# Altium schematic sheet clouds_v302_1.SchDoc: clouds_v302
size 409 x 282 mm; Date: 3/31/2017 1:28:50 PM; SheetNumber: 2
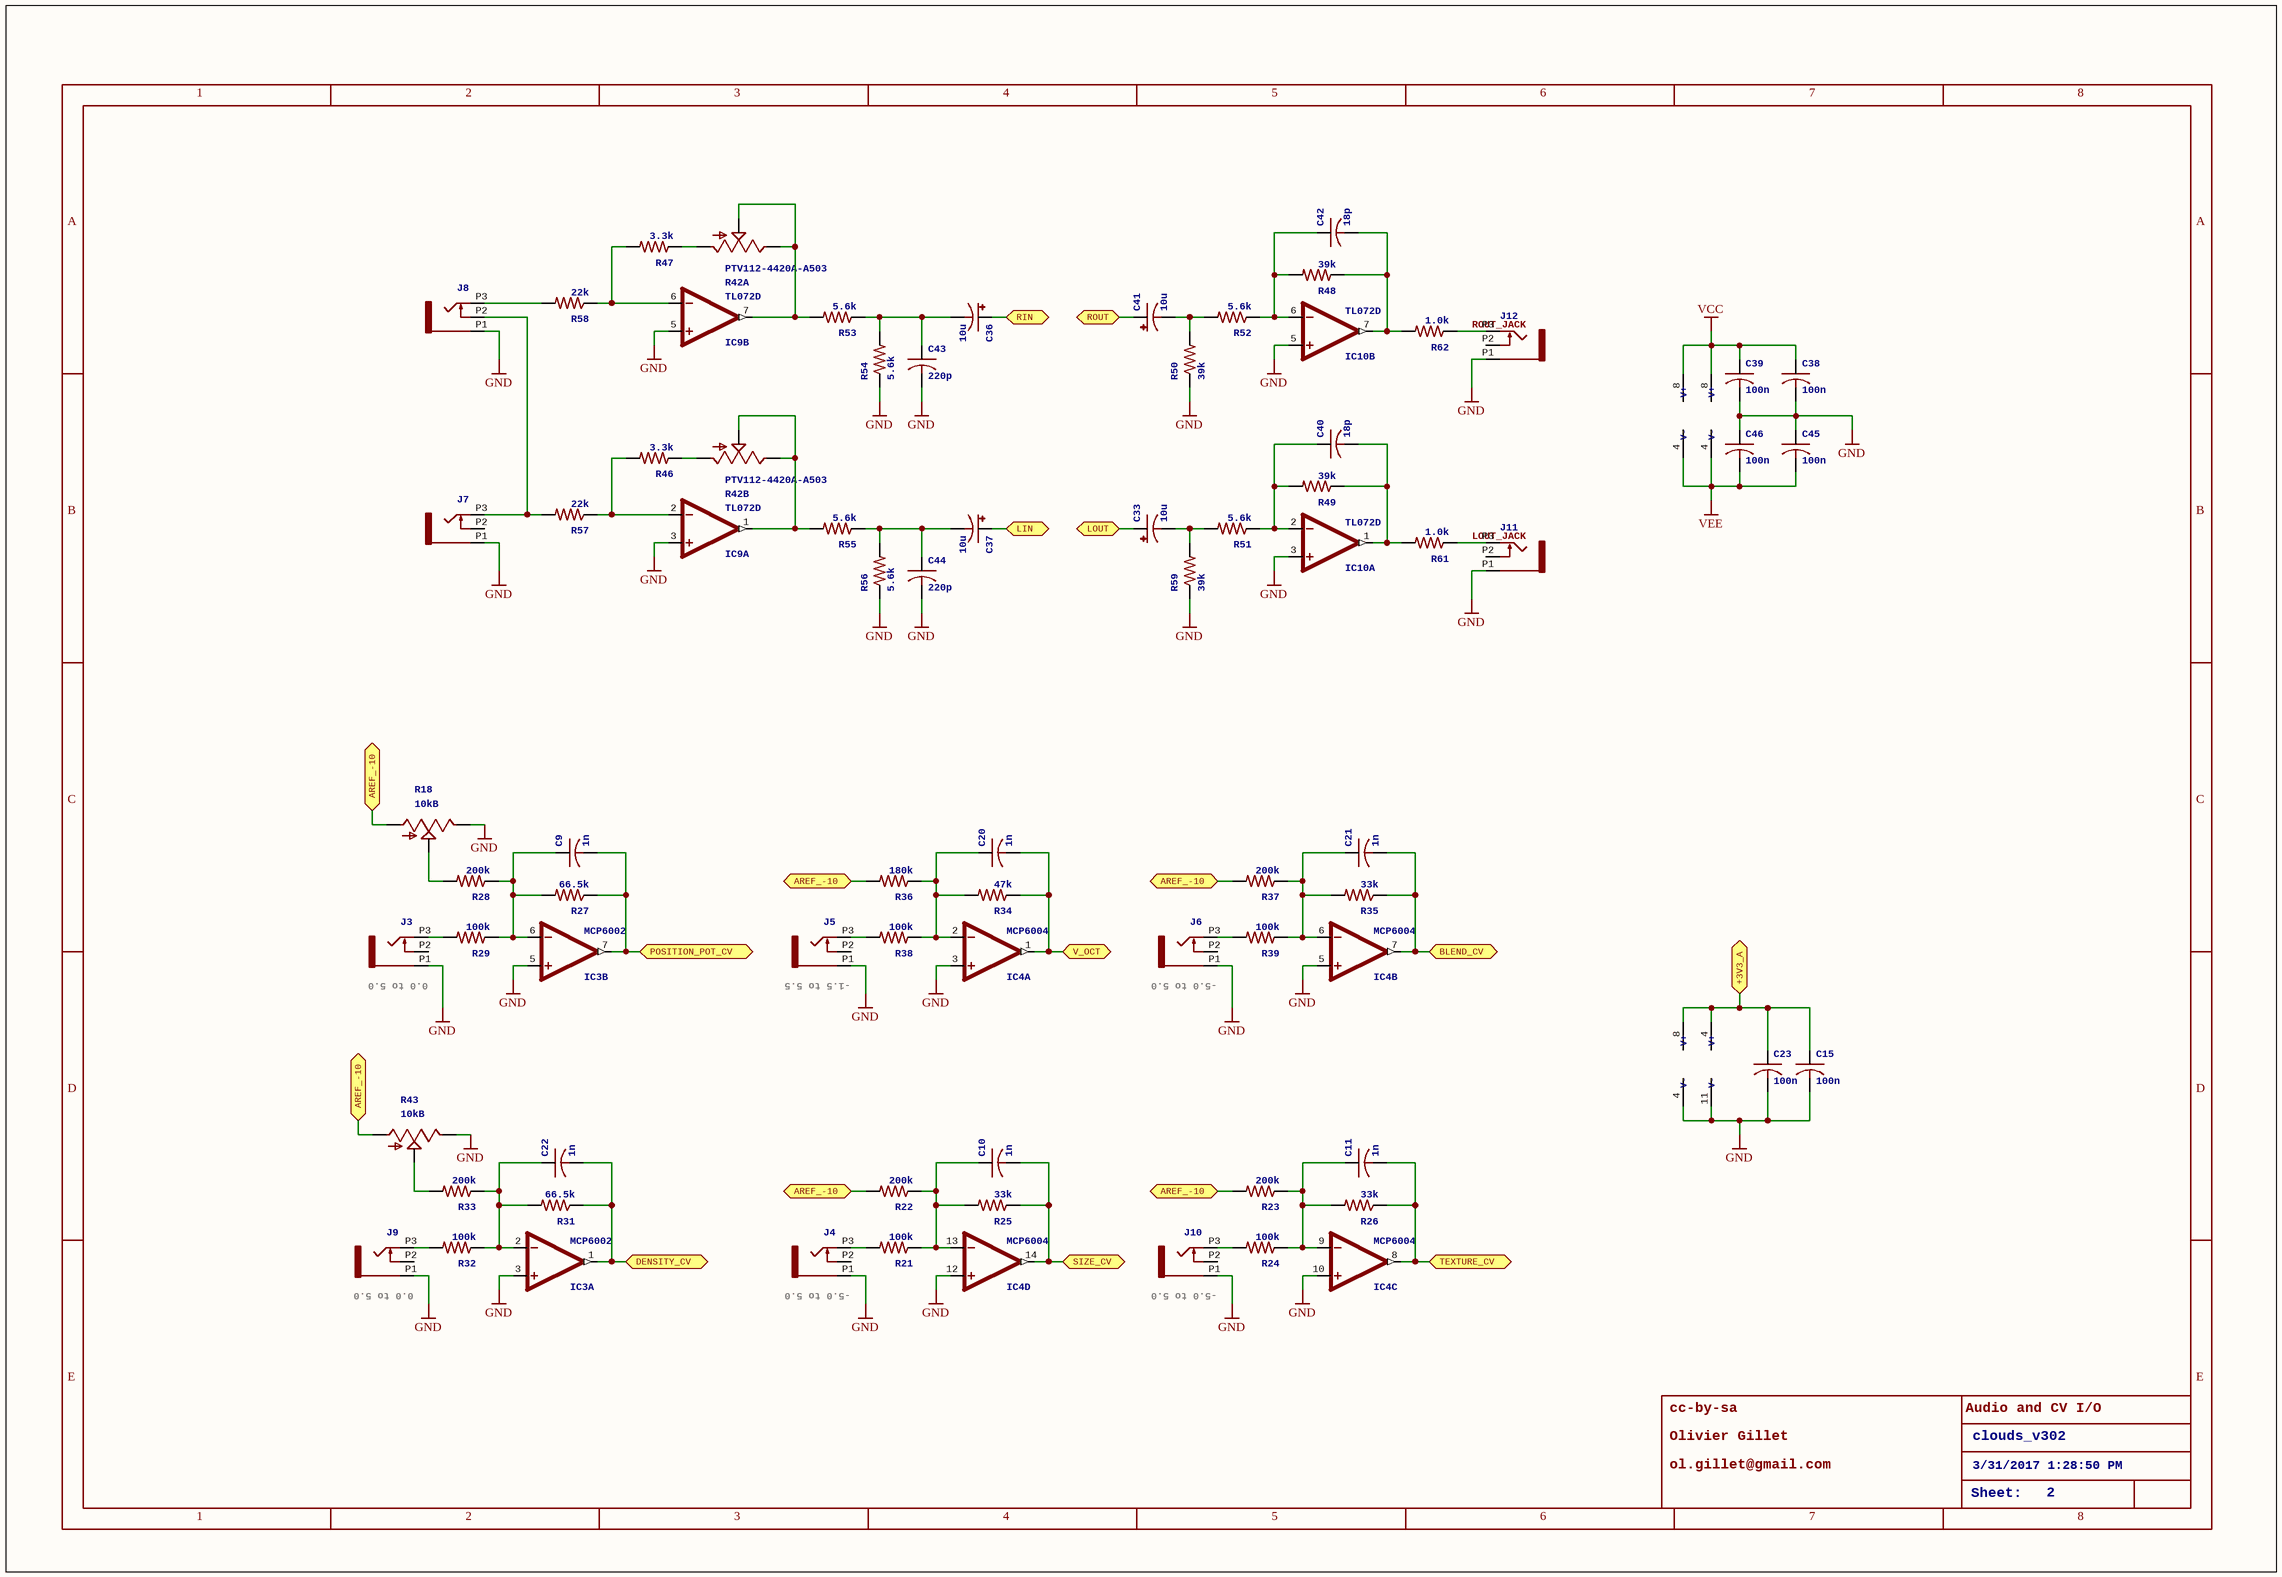
[diagram p0: clouds_v302_1.SchDoc]

## Parts
C9  1n  [C0603]
C10  1n  [C0603]
C11  1n  [C0603]
C15  100n  [C0603]
C20  1n  [C0603]
C21  1n  [C0603]
C22  1n  [C0603]
C23  100n  [C0603]
C33  10u  [PANASONIC_B]
C36  10u  [PANASONIC_B]
C37  10u  [PANASONIC_B]
C38  100n  [C0603]
C39  100n  [C0603]
C40  18p  [C0603]
C41  10u  [PANASONIC_B]
C42  18p  [C0603]
C43  220p  [C0603]
C44  220p  [C0603]
C45  100n  [C0603]
C46  100n  [C0603]
IC3  MCP6002  [SO08]  (parts A,B,C of 3)
IC4  MCP6004  [SO14]  (parts A,B,C,D,E of 5)
IC9  TL072D  [SO08]  (parts A,B,C of 3)
IC10  TL072D  [SO08]  (parts A,B,C of 3)
J3  PJ301_THONKICONN6  [WQP_PJ_301M6]  (value not drawn)
J4  PJ301_THONKICONN6  [WQP_PJ_301M6]  (value not drawn)
J5  PJ301_THONKICONN6  [WQP_PJ_301M6]  (value not drawn)
J6  PJ301_THONKICONN6  [WQP_PJ_301M6]  (value not drawn)
J7  PJ301_THONKICONN6  [WQP_PJ_301M6]  (value not drawn)
J8  PJ301_THONKICONN6  [WQP_PJ_301M6]  (value not drawn)
J9  PJ301_THONKICONN6  [WQP_PJ_301M6]  (value not drawn)
J10  PJ301_THONKICONN6  [WQP_PJ_301M6]  (value not drawn)
J11  PJ301_THONKICONN6  [WQP_PJ_301M6]  (value not drawn)
J12  PJ301_THONKICONN6  [WQP_PJ_301M6]  (value not drawn)
R18  10kB  [ALPS_POT_VERTICAL_PS]
R21  100k  [R0603]
R22  200k  [R0603]
R23  200k  [R0603]
R24  100k  [R0603]
R25  33k  [R0603]
R26  33k  [R0603]
R27  66.5k  [R0603]
R28  200k  [R0603]
R29  100k  [R0603]
R31  66.5k  [R0603]
R32  100k  [R0603]
R33  200k  [R0603]
R34  47k  [R0603]
R35  33k  [R0603]
R36  180k  [R0603]
R37  200k  [R0603]
R38  100k  [R0603]
R39  100k  [R0603]
R42  PTV112-4420A-A503  [BOURNS_PTV112]  (parts A,B of 2)
R43  10kB  [ALPS_POT_VERTICAL_PS]
R46  3.3k  [R0603]
R47  3.3k  [R0603]
R48  39k  [R0603]
R49  39k  [R0603]
R50  39k  [R0603]
R51  5.6k  [R0603]
R52  5.6k  [R0603]
R53  5.6k  [R0603]
R54  5.6k  [R0603]
R55  5.6k  [R0603]
R56  5.6k  [R0603]
R57  22k  [R0603]
R58  22k  [R0603]
R59  39k  [R0603]
R61  1.0k  [R0603]
R62  1.0k  [R0603]

## Ports
+3V3_A, AREF_-10, BLEND_CV, DENSITY_CV, LIN, LOUT, POSITION_POT_CV, RIN, ROUT, SIZE_CV, TEXTURE_CV, V_OCT

## Nets
GND: C15.2 C23.2 C38.2 C39.2 C43.2 C44.2 C45.1 C46.1 IC3.3(+IN) IC3.4(V-) IC3.5(+IN) IC4.3(+IN) IC4.5(+IN) IC4.10(+IN) IC4.11(V-) IC4.12(+IN) IC9.3(+IN) IC9.5(+IN) IC10.3(+IN) IC10.5(+IN) J3.P1 J4.P1 J5.P1 J6.P1 J7.P1 J8.P1 J9.P1 J10.P1 J11.P1 J12.P1 R18.P$1(E) R43.P$1(E) R50.1 R54.1 R56.1 R59.1
VCC: C38.1 C39.1 IC9.8(V+) IC10.8(V+)
VEE: C45.2 C46.2 IC9.4(V-) IC10.4(V-)
+3V3_A: C15.1 C23.1 IC3.8(V+) IC4.4(V+) ; port +3V3_A
AREF_-10: R18.P$3(A) R22.2 R23.2 R36.2 R37.2 R43.P$3(A) ; port AREF_-10
BLEND_CV: C21.2 IC4.7(OUT) R35.1 ; port BLEND_CV
DENSITY_CV: C22.2 IC3.1(OUT) R31.1 ; port DENSITY_CV
LIN: C37.+ ; port LIN
LOUT: C33.+ ; port LOUT
LOUT_JACK: J11.P3 R61.1
POSITION_POT_CV: C9.2 IC3.7(OUT) R27.1 ; port POSITION_POT_CV
RIN: C36.+ ; port RIN
ROUT: C41.+ ; port ROUT
ROUT_JACK: J12.P3 R62.1
SIZE_CV: C10.2 IC4.14(OUT) R25.1 ; port SIZE_CV
TEXTURE_CV: C11.2 IC4.8(OUT) R26.1 ; port TEXTURE_CV
V_OCT: C20.2 IC4.1(OUT) R34.1 ; port V_OCT
NetC9_1: C9.1 IC3.6(-IN) R27.2 R28.1 R29.1
NetC10_1: C10.1 IC4.13(-IN) R21.1 R22.1 R25.2
NetC11_1: C11.1 IC4.9(-IN) R23.1 R24.1 R26.2
NetC20_1: C20.1 IC4.2(-IN) R34.2 R36.1 R38.1
NetC21_1: C21.1 IC4.6(-IN) R35.2 R37.1 R39.1
NetC22_1: C22.1 IC3.2(-IN) R31.2 R32.1 R33.1
NetC33_-: C33.- R51.2 R59.2
NetC36_-: C36.- C43.1 R53.1 R54.2
NetC37_-: C37.- C44.1 R55.1 R56.2
NetC40_1: C40.1 IC10.2(-IN) R49.2 R51.1
NetC40_2: C40.2 IC10.1(OUT) R49.1 R61.2
NetC41_-: C41.- R50.2 R52.2
NetC42_1: C42.1 IC10.6(-IN) R48.2 R52.1
NetC42_2: C42.2 IC10.7(OUT) R48.1 R62.2
NetIC9_1: IC9.1(OUT) R42.2(S) R42.3(E) R55.2
NetIC9_2: IC9.2(-IN) R46.2 R57.1
NetIC9_6: IC9.6(-IN) R47.2 R58.1
NetIC9_7: IC9.7(OUT) R42.2P(S) R42.3P(E) R53.2
NetJ3_P3: J3.P3 R29.2
NetJ4_P3: J4.P3 R21.2
NetJ5_P3: J5.P3 R38.2
NetJ6_P3: J6.P3 R39.2
NetJ7_P3: J7.P3 J8.P2 R57.2
NetJ8_P3: J8.P3 R58.2
NetJ9_P3: J9.P3 R32.2
NetJ10_P3: J10.P3 R24.2
NetR18_P$2: R18.P$2(S) R28.2
NetR33_2: R33.2 R43.P$2(S)
NetR42_1: R42.1(A) R46.1
NetR42_1P: R42.1P(A) R47.1

Not connected (* = marked no-connect by the designer): J3 P2(2); J4 P2(2); J5 P2(2); J6 P2(2); J7 P2(2); J9 P2(2); J10 P2(2); J11 P2(2); J12 P2(2)

## Notes on the sheet
- (near J3) 0.0 to 5.0
- (near J5) -1.5 to 5.5
- (near J6) -5.0 to 5.0
- (near J9) 0.0 to 5.0
- (near J4) -5.0 to 5.0
- (near J10) -5.0 to 5.0
- cc-by-sa
- Olivier Gillet
- Audio and CV I/O
- clouds_v302
- ol.gillet@gmail.com
- Sheet:
- 3/31/2017 1:28:50 PM
- 2
- 1
- 3
- 4
- 5
- 6
- 7
- 8
- A
- B
- C
- D
- E

## Library data of the parts
C9-C11 C15 C20-C23 C38-C40 C42-C46 = C-USC0603: CAPACITOR, American symbol
C33 C36 C37 C41 = CPOL-USB: POLARIZED CAPACITOR, American symbol
IC3 IC9 IC10 = TL072D: OP AMP
IC4 = TL074D: OP AMP
R18 R43 = POT_USVERTICAL_PS
R21-R29 R31-R39 R46-R59 R61 R62 = R-US_R0603: RESISTOR, American symbol
R42 = POT_US_DUAL_GANG